# Altium schematic sheet Sheet3.SchDoc
size A4
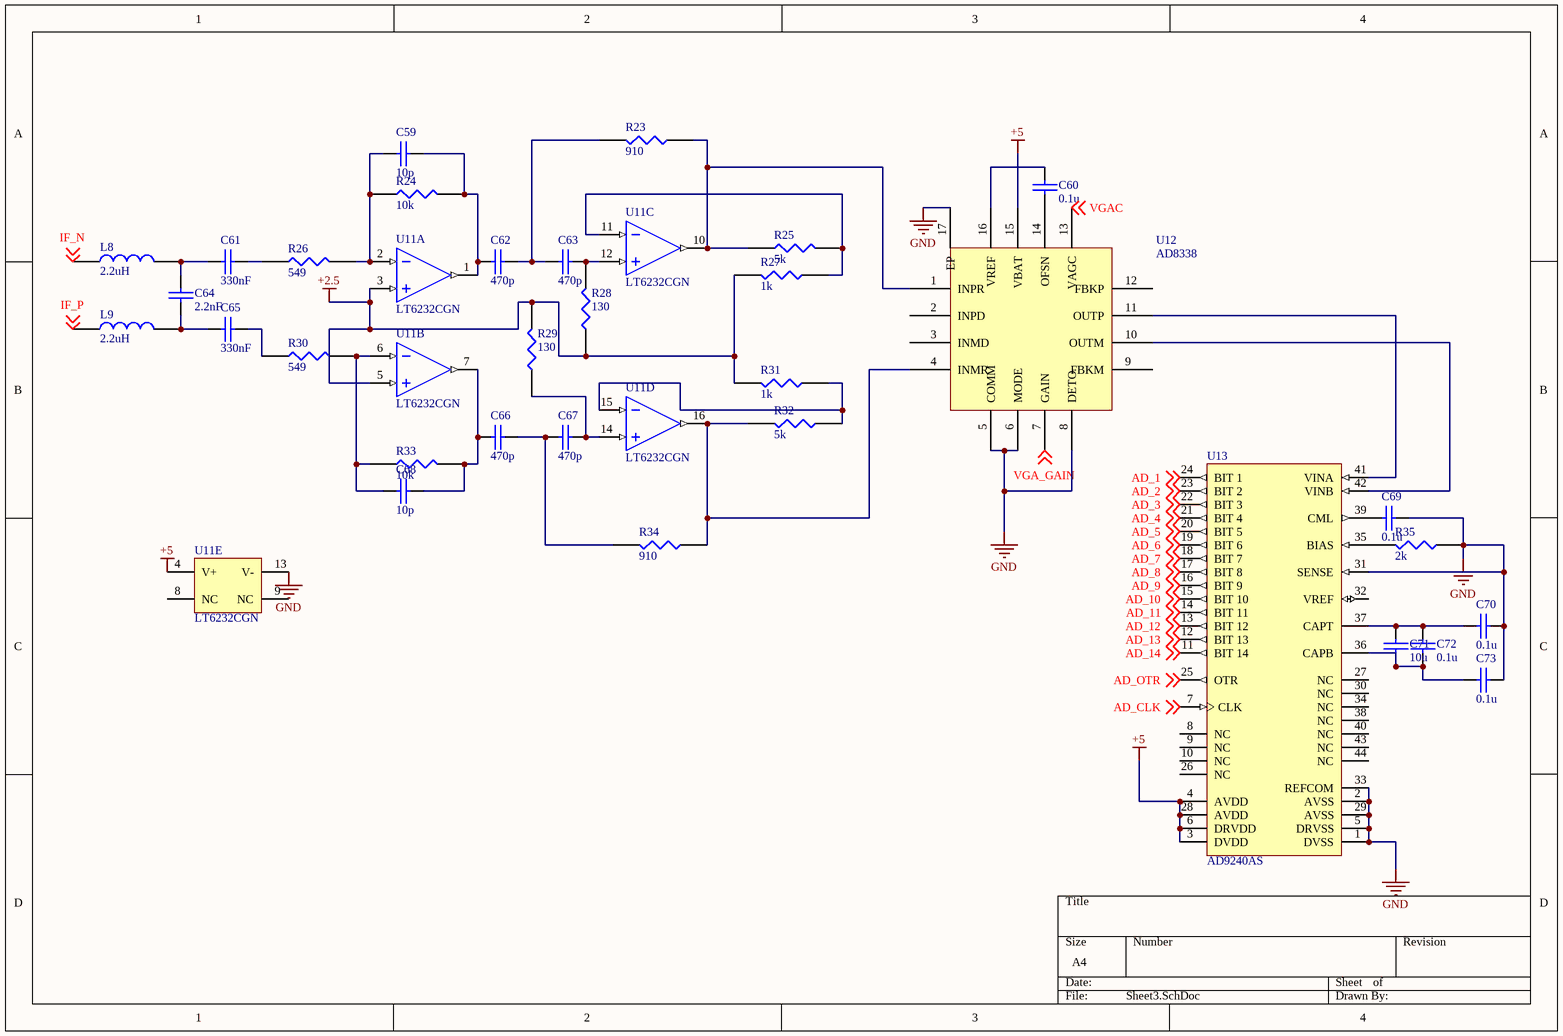
[diagram p0: Sheet3.SchDoc]

## Parts
C59  10p  [0603_R]
C60  0.1u  [0603_R]
C61  330nF  [0603_R]
C62  470p  [0603_R]
C63  470p  [0603_R]
C64  2.2nF  [0603_R]
C65  330nF  [0603_R]
C66  470p  [0603_R]
C67  470p  [0603_R]
C68  10p  [0603_R]
C69  0.1u  [0603_R]
C70  0.1u  [0603_R]
C71  10u  [0603_R]
C72  0.1u  [0603_R]
C73  0.1u  [0603_R]
L8  2.2uH  [0603_R]
L9  2.2uH  [0603_R]
R23  910  [0603_R]
R24  10k  [0603_R]
R25  5k  [0603_R]
R26  549  [0603_R]
R27  1k  [0603_R]
R28  130  [0603_R]
R29  130  [0603_R]
R30  549  [0603_R]
R31  1k  [0603_R]
R32  5k  [0603_R]
R33  10k  [0603_R]
R34  910  [0603_R]
R35  2k  [0603_R]
U11  LT6232CGN  [LT-GN-16_N]  (parts A,B,C,D,E of 5)
U12  AD8338  [LCC16-AD8338]
U13  AD9240AS  [S-44-1_N]

## Nets
+2.5: R27.2 R28.1 R29.2 R31.2 U11.3(+IN_A) U11.5(+IN_B)
+5: U11.4(V+) U12.15(VBAT) U13.3(DVDD) U13.4(AVDD) U13.6(DRVDD) U13.28(AVDD)
GND: C69.2 C70.2 C73.2 R35.1 U11.13(V-) U12.5(COMM) U12.6(MODE) U12.8(DETO) U12.17(EP) U13.1(DVSS) U13.2(AVSS) U13.5(DRVSS) U13.29(AVSS) U13.31(SENSE) U13.33(REFCOM)
AD_1: U13.24(BIT_1) ; off-sheet AD_1
AD_2: U13.23(BIT_2) ; off-sheet AD_2
AD_3: U13.22(BIT_3) ; off-sheet AD_3
AD_4: U13.21(BIT_4) ; off-sheet AD_4
AD_5: U13.20(BIT_5) ; off-sheet AD_5
AD_6: U13.19(BIT_6) ; off-sheet AD_6
AD_7: U13.18(BIT_7) ; off-sheet AD_7
AD_8: U13.17(BIT_8) ; off-sheet AD_8
AD_9: U13.16(BIT_9) ; off-sheet AD_9
AD_10: U13.15(BIT_10) ; off-sheet AD_10
AD_11: U13.14(BIT_11) ; off-sheet AD_11
AD_12: U13.13(BIT_12) ; off-sheet AD_12
AD_13: U13.12(BIT_13) ; off-sheet AD_13
AD_14: U13.11(BIT_14) ; off-sheet AD_14
AD_CLK: U13.7(CLK) ; off-sheet AD_CLK
AD_OTR: U13.25(OTR) ; off-sheet AD_OTR
IF_N: L8.1 ; off-sheet IF_N
IF_P: L9.1 ; off-sheet IF_P
VGA_GAIN: U12.7(GAIN) ; off-sheet VGA_GAIN
VGAC: U12.13(VAGC) ; off-sheet VGAC
NetC59_1: C59.1 C62.2 R24.2 U11.1(OUT_A)
NetC59_2: C59.2 R24.1 R26.2 U11.2(-IN_A)
NetC60_1: C60.1 U12.16(VREF)
NetC60_2: C60.2 U12.14(OFSN)
NetC61_1: C61.1 R26.1
NetC61_2: C61.2 C64.2 L8.2
NetC62_1: C62.1 C63.2 R23.2
NetC63_1: C63.1 R28.2 U11.12(+IN_C)
NetC64_1: C64.1 C65.2 L9.2
NetC65_1: C65.1 R30.1
NetC66_1: C66.1 C67.2 R34.2
NetC66_2: C66.2 C68.1 R33.2 U11.7(OUT_B)
NetC67_1: C67.1 R29.1 U11.14(+IN_D)
NetC68_2: C68.2 R30.2 R33.1 U11.6(-IN_B)
NetC69_1: C69.1 U13.39(CML)
NetC70_1: C70.1 C71.2 C72.2 U13.37(CAPT)
NetC71_1: C71.1 C72.1 C73.1 U13.36(CAPB)
NetR23_1: R23.1 R25.1 U11.10(OUT_C) U12.1(INPR)
NetR25_2: R25.2 R27.1 U11.11(-IN_C)
NetR31_1: R31.1 R32.1 U11.15(-IN_D)
NetR32_2: R32.2 R34.1 U11.16(OUT_D) U12.4(INMR)
NetR35_2: R35.2 U13.35(BIAS)
NetU12_10: U12.10(OUTM) U13.42(VINB)
NetU12_11: U12.11(OUTP) U13.41(VINA)

Not connected (* = marked no-connect by the designer): U11 8(NC) 9(NC); U12 2(INPD) 3(INMD) 9(FBKM) 12(FBKP); U13 8(NC) 9(NC) 10(NC) 26(NC) 27(NC) 30(NC) 32(VREF) 34(NC) 38(NC) 40(NC) 43(NC) 44(NC)

## Library data of the parts
C59-C73 = CAP: Capacitor
L8 L9 = INDUCTOR
R23-R35 = RES1
U11 = LT6232CGN: Quad Channel, Ultralow Noise, Low Power, High Speed Operational Amplifier, 215 MHz Typical GBW, 70 V/us Typical SR, 3 to 12.6 V, 16-Pin SOP (GN-16), Commercial; Linear Technology Part Number: LT6232; Manufacturer: Linear Technology; Channels (#): 4; GBW (MHz) Typical: 215; Is (mA) Typical: 3.3; SR (V/us) Typical: 70; Vos (mV) Guaranteed: 0.35; Vos (mV) Typical: 0.05; Vs Max (V): 12.6; Vs Min (V): 3; DatasheetVersion: Rev. C; PackageVersion: Rev B; PackageReference: LT-GN-16; PackageDescription: 16-Lead Plastic SSOP, Body 4.9 x 3.9 mm, Pitch 0.635 mm; Supplier 1: Digi-Key; Supplier Part Number 1: LT6232CGN-ND; Type: VFB; Mounting Technology: Surface Mount; PartNumber: LT6232CGN; ComponentLink1Description: Manufacturer URL; ComponentLink1URL: http://www.linear.com/; ComponentLink2Description: Datasheet; ComponentLink2URL: http://cds.linear.com/docs/en/datasheet/623012fc.pdf; ComponentLink3Description: Package Specification; ComponentLink3URL: http://cds.linear.com/docs/en/packaging/05081641_B_GN16.pdf
U13 = AD9240AS: Single 14-Bit Monolithic Analog-to-Digital Converter with Parallel Interface, 10MSPS, -55 to +85 degC, S-44-1, Tray; Generic Part Number: AD9240; Manufacturer: Analog Devices; Resolution (Bits): 14; Channels: 1; Throughput Rate (SPS): 10M; Interface: Par; DatasheetVersion: Rev.B; PackageVersion: 041807-A; PackageReference: S-44-1; PackageDescription: 44-Lead Metric Quad Flat Package [MQFP]; Supplier 1: Digi-Key; Supplier Part Number 1: AD9240AS-ND; Supplier 2: Mouser; Supplier Part Number 2: 584-AD9240AS; RoHS: N; Packing: Tray; Mounting Technology: Surface Mount; Code_JEDEC: MS-022-AB-1; PartNumber: AD9240AS; ComponentLink1Description: Manufacturer URL; ComponentLink1URL: http://www.analog.com/en/index.html; ComponentLink2Description: Datasheet; ComponentLink2URL: http://www.analog.com/static/imported-files/data_sheets/AD9240.pdf; ComponentLink3Description: Package Specification; ComponentLink3URL: http://www.analog.com/static/imported-files/packages/217364S_44_1.pdf; ComponentLink4Description: Product URL; ComponentLink4URL: http://www.analog.com/en/analog-to-digital-converters/ad-converters/ad9240/products/product.html